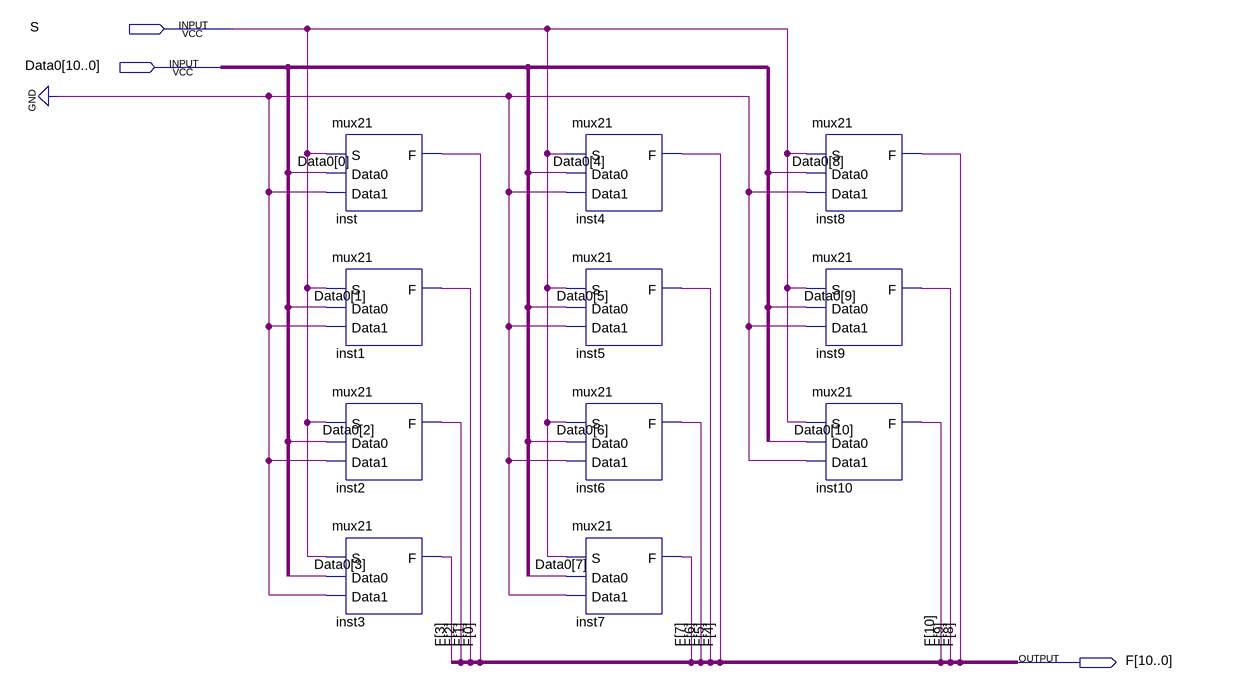
[diagram p0: schematic sheet]
// Quartus schematic control_mux.bdf as structural Verilog: 11 symbols, 3 pins
module control_mux (
  input  S,
  input  [10:0] Data0,
  output [10:0] F
);

  mux21 inst (.S(S), .Data0(Data0[0]), .Data1(1'b0), .F(F[0]));
  mux21 inst1 (.S(S), .Data0(Data0[1]), .Data1(1'b0), .F(F[1]));
  mux21 inst2 (.S(S), .Data0(Data0[2]), .Data1(1'b0), .F(F[2]));
  mux21 inst3 (.S(S), .Data0(Data0[3]), .Data1(1'b0), .F(F[3]));
  mux21 inst4 (.S(S), .Data0(Data0[4]), .Data1(1'b0), .F(F[4]));
  mux21 inst5 (.S(S), .Data0(Data0[5]), .Data1(1'b0), .F(F[5]));
  mux21 inst6 (.S(S), .Data0(Data0[6]), .Data1(1'b0), .F(F[6]));
  mux21 inst7 (.S(S), .Data0(Data0[7]), .Data1(1'b0), .F(F[7]));
  mux21 inst8 (.S(S), .Data0(Data0[8]), .Data1(1'b0), .F(F[8]));
  mux21 inst9 (.S(S), .Data0(Data0[9]), .Data1(1'b0), .F(F[9]));
  mux21 inst10 (.S(S), .Data0(Data0[10]), .Data1(1'b0), .F(F[10]));
endmodule
